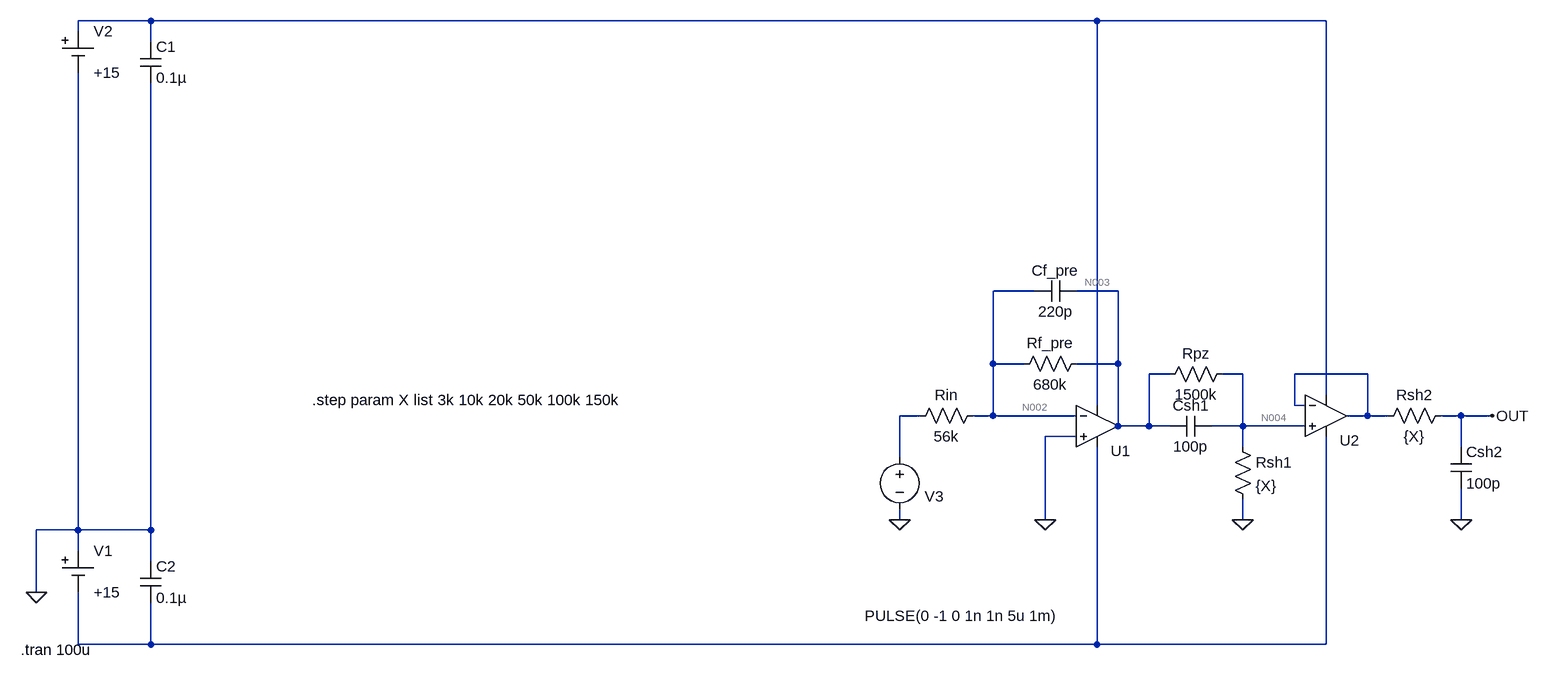
[diagram p0: schematic Circ_3.asc]
Circ_3.asc, the LTspice schematic file:
Version 4
SHEET 1 2164 680
WIRE -432 -624 -544 -624
WIRE 1024 -624 -432 -624
WIRE 1376 -624 1024 -624
WIRE -544 -608 -544 -624
WIRE -432 -592 -432 -624
WIRE 928 -208 864 -208
WIRE 1056 -208 992 -208
WIRE 864 -96 864 -208
WIRE 912 -96 864 -96
WIRE 1056 -96 1056 -208
WIRE 1056 -96 992 -96
WIRE 1136 -80 1104 -80
WIRE 1248 -80 1216 -80
WIRE 1440 -80 1328 -80
WIRE 1376 -48 1376 -624
WIRE 1024 -32 1024 -624
WIRE 1328 -32 1328 -80
WIRE 1344 -32 1328 -32
WIRE 752 -16 720 -16
WIRE 864 -16 864 -96
WIRE 864 -16 832 -16
WIRE 992 -16 864 -16
WIRE 1440 -16 1440 -80
WIRE 1440 -16 1408 -16
WIRE 1472 -16 1440 -16
WIRE 1584 -16 1552 -16
WIRE 1632 -16 1584 -16
WIRE 1056 0 1056 -96
WIRE 1104 0 1104 -80
WIRE 1104 0 1056 0
WIRE 1136 0 1104 0
WIRE 1248 0 1248 -80
WIRE 1248 0 1200 0
WIRE 1344 0 1248 0
WIRE 992 16 944 16
WIRE 1248 32 1248 0
WIRE 1584 32 1584 -16
WIRE 720 48 720 -16
WIRE 720 144 720 128
WIRE 944 144 944 16
WIRE 1248 144 1248 112
WIRE 1584 144 1584 96
WIRE -544 160 -544 -544
WIRE -544 160 -608 160
WIRE -432 160 -432 -528
WIRE -432 160 -544 160
WIRE -544 192 -544 160
WIRE -432 208 -432 160
WIRE -608 256 -608 160
WIRE -544 336 -544 256
WIRE -432 336 -432 272
WIRE -432 336 -544 336
WIRE 1024 336 1024 32
WIRE 1024 336 -432 336
WIRE 1376 336 1376 16
WIRE 1376 336 1024 336
FLAG -608 256 0
FLAG 1248 144 0
FLAG 1584 144 0
FLAG 1632 -16 OUT
FLAG 720 144 0
FLAG 944 144 0
SYMBOL cap -448 208 R0
SYMATTR InstName C2
SYMATTR Value 0.1µ
SYMBOL Misc\\cell -544 192 R0
WINDOW 123 0 0 Left 0
WINDOW 39 0 0 Left 0
SYMATTR InstName V1
SYMATTR Value +15
SYMBOL Misc\\cell -544 -608 R0
WINDOW 123 0 0 Left 0
WINDOW 39 0 0 Left 0
SYMATTR InstName V2
SYMATTR Value +15
SYMBOL cap -448 -592 R0
SYMATTR InstName C1
SYMATTR Value 0.1µ
SYMBOL Opamps/UniversalOpamp2 1376 -16 R0
WINDOW 0 21 38 Left 2
SYMATTR InstName U2
SYMBOL cap 1200 -16 R90
WINDOW 0 0 32 VBottom 2
WINDOW 3 32 32 VTop 2
SYMATTR InstName Csh1
SYMATTR Value 100p
SYMBOL res 1232 16 R0
SYMATTR InstName Rsh1
SYMATTR Value {X}
SYMBOL res 1568 -32 R90
WINDOW 0 0 56 VBottom 2
WINDOW 3 32 56 VTop 2
SYMATTR InstName Rsh2
SYMATTR Value {X}
SYMBOL cap 1568 32 R0
SYMATTR InstName Csh2
SYMATTR Value 100p
SYMBOL Opamps/UniversalOpamp2 1024 0 R0
WINDOW 0 21 38 Left 2
SYMATTR InstName U1
SYMBOL res 1008 -112 R90
WINDOW 0 0 56 VBottom 2
WINDOW 3 32 56 VTop 2
SYMATTR InstName Rf_pre
SYMATTR Value 680k
SYMBOL cap 992 -224 R90
WINDOW 0 0 32 VBottom 2
WINDOW 3 32 32 VTop 2
SYMATTR InstName Cf_pre
SYMATTR Value 220p
SYMBOL res 848 -32 R90
WINDOW 0 0 56 VBottom 2
WINDOW 3 32 56 VTop 2
SYMATTR InstName Rin
SYMATTR Value 56k
SYMBOL voltage 720 32 R0
WINDOW 123 0 0 Left 0
WINDOW 39 0 0 Left 0
WINDOW 0 39 76 Left 2
WINDOW 3 -54 260 Left 2
SYMATTR InstName V3
SYMATTR Value PULSE(0 -1 0 1n 1n 5u 1m)
SYMBOL res 1232 -96 R90
WINDOW 0 0 56 VBottom 2
WINDOW 3 32 56 VTop 2
SYMATTR InstName Rpz
SYMATTR Value 1500k
TEXT -632 344 Left 2 !.tran 100u
TEXT -184 -40 Left 2 !.step param X list 3k 10k 20k 50k 100k 150k

The netlist it stands for:
* Circ_3.asc
C2 0 N007 0.1µ
V1 0 N007 +15
V2 N001 0 +15
C1 N001 0 0.1µ
XU2 N004 N005 N001 N007 N005 level.2 Avol=1Meg GBW=10Meg Slew=10Meg ilimit=25m rail=0 Vos=0 phimargin=45 en=0 enk=0 in=0 ink=0 Rin=500Meg  ; pins IN+ IN- V+ V- OUT
Csh1 N004 N003 100p
Rsh1 N004 0 {X}
Rsh2 OUT N005 {X}
Csh2 OUT 0 100p
XU1 0 N002 N001 N007 N003 level.2 Avol=1Meg GBW=10Meg Slew=10Meg ilimit=25m rail=0 Vos=0 phimargin=45 en=0 enk=0 in=0 ink=0 Rin=500Meg  ; pins IN+ IN- V+ V- OUT
Rf_pre N003 N002 680k
Cf_pre N003 N002 220p
Rin N002 N006 56k
V3 N006 0 PULSE(0 -1 0 1n 1n 5u 1m)
Rpz N004 N003 1500k
.tran 100u
.step param X list 3k 10k 20k 50k 100k 150k
.lib UniversalOpamps2.sub
.backanno
.end

* Results of the author's LTspice run, read from the files saved beside the schematic
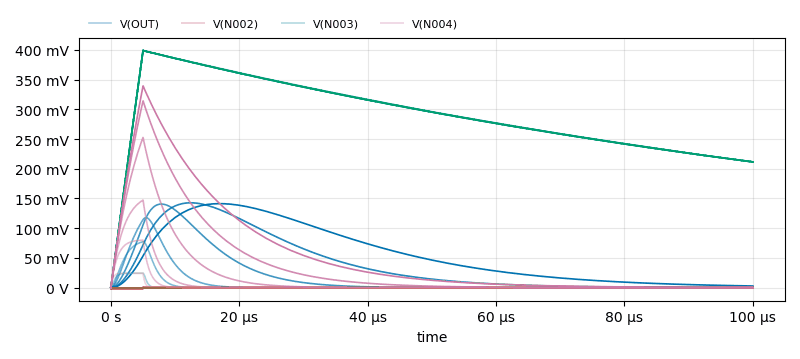
[diagram p1: Transient Analysis of Circ_3.asc, plotted from the saved traces]
* Transient Analysis, 6 runs:
*   V(OUT) [run 1]: min -942.5 nV, max 24.27 mV, average 1.213 mV, rms 5.177 mV, last -589.8 nV
*   V(OUT) [run 2]: min -2.928 µV, max 77.33 mV, average 4.024 mV, rms 15.13 mV, last -1.975 µV
*   V(OUT) [run 3]: min -5.51 µV, max 117.9 mV, average 7.996 mV, rms 25.11 mV, last -3.977 µV
*   V(OUT) [run 4]: min -10.6 µV, max 140.6 mV, average 19.61 mV, rms 42.92 mV, last -10.13 µV
*   V(OUT) [run 5]: min 0 V, max 142.7 mV, average 37.97 mV, rms 60.49 mV, last 150.3 µV
*   V(OUT) [run 6]: min 0 V, max 141.3 mV, average 54.76 mV, rms 72.69 mV, last 2.894 mV
*   V(N002) [run 1]: min -1.847 mV, max 442.1 µV, average -33.87 µV, rms 286.7 µV, last 22.28 µV
*   V(N002) [run 2]: min -1.822 mV, max 441.4 µV, average -33.86 µV, rms 286.6 µV, last 22.27 µV
*   V(N002) [run 3]: min -1.767 mV, max 441.2 µV, average -33.85 µV, rms 286.5 µV, last 22.27 µV
*   V(N002) [run 4]: min -1.71 mV, max 441.1 µV, average -33.89 µV, rms 286.5 µV, last 22.27 µV
*   V(N002) [run 5]: min -1.646 mV, max 441.1 µV, average -33.87 µV, rms 286.4 µV, last 22.27 µV
*   V(N002) [run 6]: min -1.647 mV, max 441.1 µV, average -33.89 µV, rms 286.5 µV, last 22.27 µV
*   V(N003) [run 1]: min -57.25 µV, max 399 mV, average 290.9 mV, rms 297.9 mV, last 211.5 mV
*   V(N003) [run 2]: min -57.3 µV, max 399 mV, average 290.8 mV, rms 297.7 mV, last 211.5 mV
*   V(N003) [run 3]: min -57.31 µV, max 399 mV, average 290.8 mV, rms 297.6 mV, last 211.5 mV
*   V(N003) [run 4]: min -57.31 µV, max 399 mV, average 290.6 mV, rms 297.2 mV, last 211.5 mV
*   V(N003) [run 5]: min -57.31 µV, max 399 mV, average 290.5 mV, rms 297.1 mV, last 211.5 mV
*   V(N003) [run 6]: min -57.31 µV, max 399 mV, average 290.5 mV, rms 297.1 mV, last 211.5 mV
*   V(N004) [run 1]: min -57.16 µV, max 24.33 mV, average 1.214 mV, rms 5.265 mV, last -588.9 nV
*   V(N004) [run 2]: min -57.27 µV, max 80.05 mV, average 4.024 mV, rms 16.13 mV, last -1.962 µV
*   V(N004) [run 3]: min -57.29 µV, max 147.3 mV, average 7.994 mV, rms 28.54 mV, last -3.924 µV
*   V(N004) [run 4]: min -57.31 µV, max 252.5 mV, average 19.61 mV, rms 53.85 mV, last -9.808 µV
*   V(N004) [run 5]: min -57.31 µV, max 314 mV, average 37.99 mV, rms 80.66 mV, last -7.123 µV
*   V(N004) [run 6]: min -57.31 µV, max 339.3 mV, average 55.23 mV, rms 99.82 mV, last 290.4 µV